# Altium schematic sheet DS1302.SchDoc
size A4
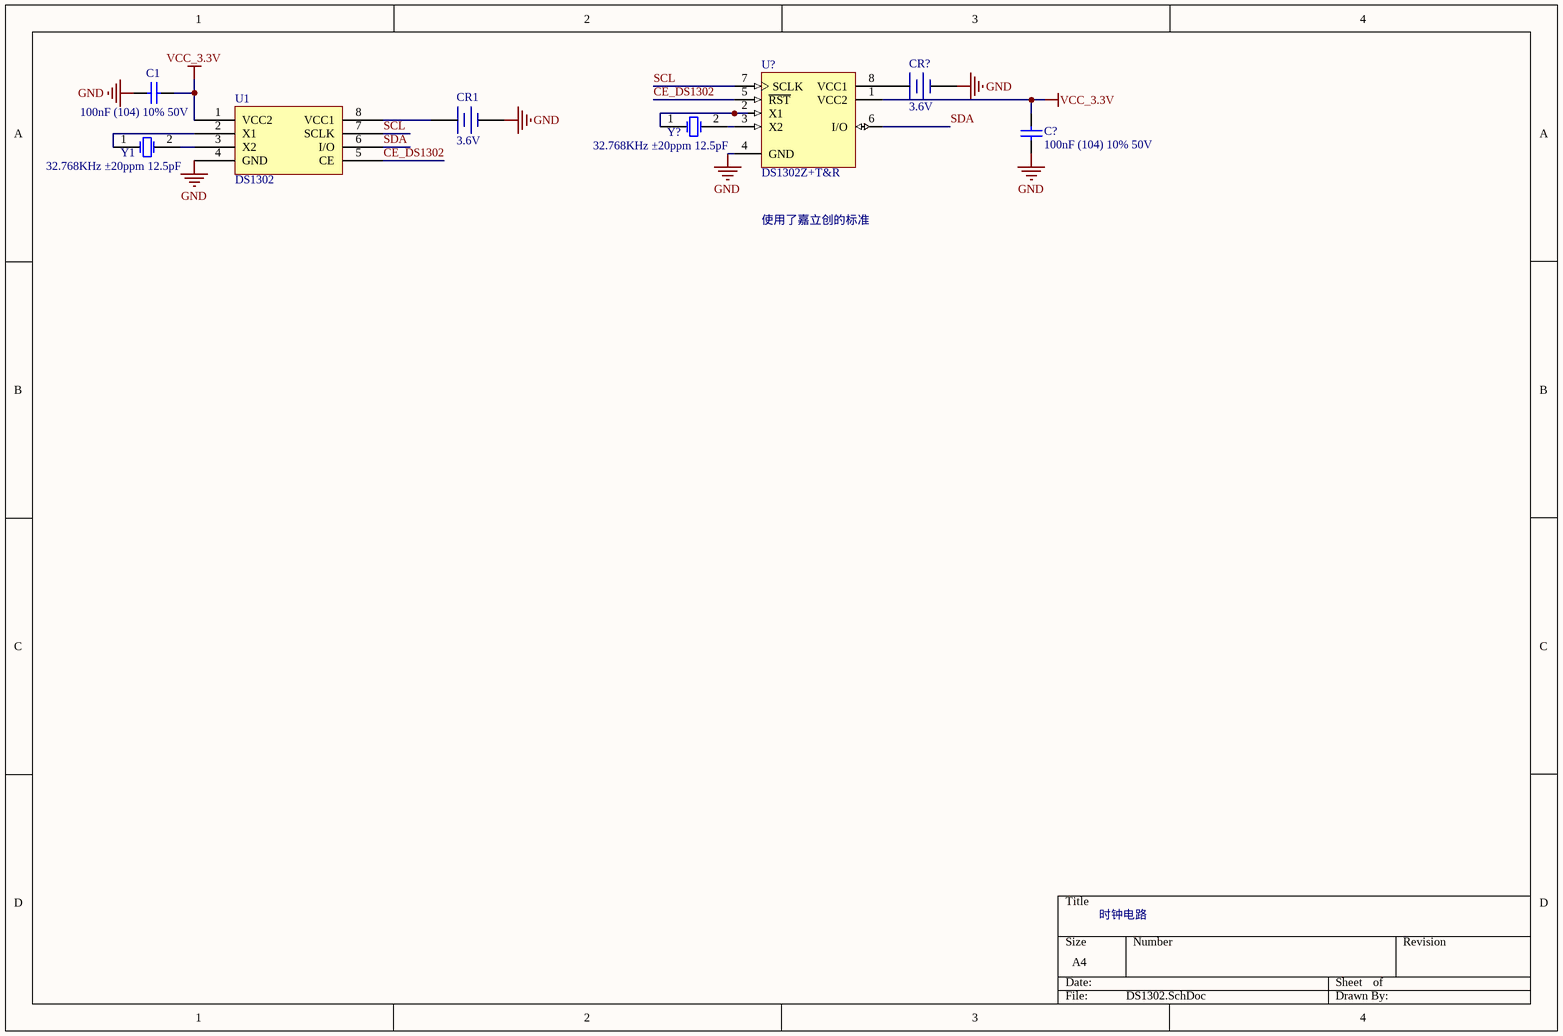
[diagram p0: DS1302.SchDoc]

## Parts
C1  100nF (104) 10% 50V  [CAPC_0603_2]
C?  100nF (104) 10% 50V  [CAPC_0603_2]
CR1  3.6V  [CR1220_A]
CR?  3.6V  [CR1220_A]
U1  DS1302  [SOIC_8]
U?  DS1302Z+T&R  [SOIC-8_150mil]
Y1  32.768KHz ±20ppm 12.5pF  [SMD-3215_2P FC - 135]
Y?  32.768KHz ±20ppm 12.5pF  [SMD-3215_2P FC - 135]

## Nets
GND: C1.1 C?.2 CR1.2(DC-) CR?.2(DC-) U1.4(GND) U?.4(GND)
VCC_3.3V: C1.2 C?.1 U1.1(VCC2) U?.1(VCC2)
CE_DS1302: U1.5(CE) U?.5(~{RST})
SCL: U1.7(SCLK) U?.7(SCLK)
SDA: U1.6(I/O) U?.6(I/O)
NetCR1_1: CR1.1(DC+) U1.8(VCC1)
NetCR?_1: CR?.1(DC+) U?.8(VCC1)
NetU1_2: U1.2(X1) Y1.1(OSC1)
NetU1_3: U1.3(X2) Y1.2(OSC2)
NetU?_2: U?.2(X1) Y?.1(OSC1)
NetU?_3: U?.3(X2) Y?.2(OSC2)

## Notes on the sheet
- 使用了嘉立创的标准
- 时钟电路

## Library data of the parts
C1 C? = 0603 100nF (104) 10% 50V: 贴片电容; ComponentLink1Description: 供应商链接; ComponentLink1URL: http://www.szlcsc.com/product/details_15331.html; Package: 0603; Supplier: LC; SuppliersPartNumber: C14663
CR1 CR? = CR-3V: 微型电池; 版权归属: 源创客; BOM名称: 微型电池; 学习资源: www.ooocke.com
U1 = Component_1
U? = DS1302Z+T&R_[C8959]: 实时时钟; ComponentLink1Description: 供应商链接; ComponentLink1URL: http://www.szlcsc.com/product/details_9478.html; Package: SOIC-8_150mil; Supplier: LC; SuppliersPartNumber: C8959
Y1 Y? = SMD-3215_2P 32.768KHz 20ppm 12.5pF: 贴片晶振; ComponentLink1Description: 供应商链接; ComponentLink1URL: http://www.szlcsc.com/product/details_33310.html; Package: SMD-3215_2P; Supplier: LC; SuppliersPartNumber: C32346